# EAGLE design bottomboard (EAGLE 9.3.0)
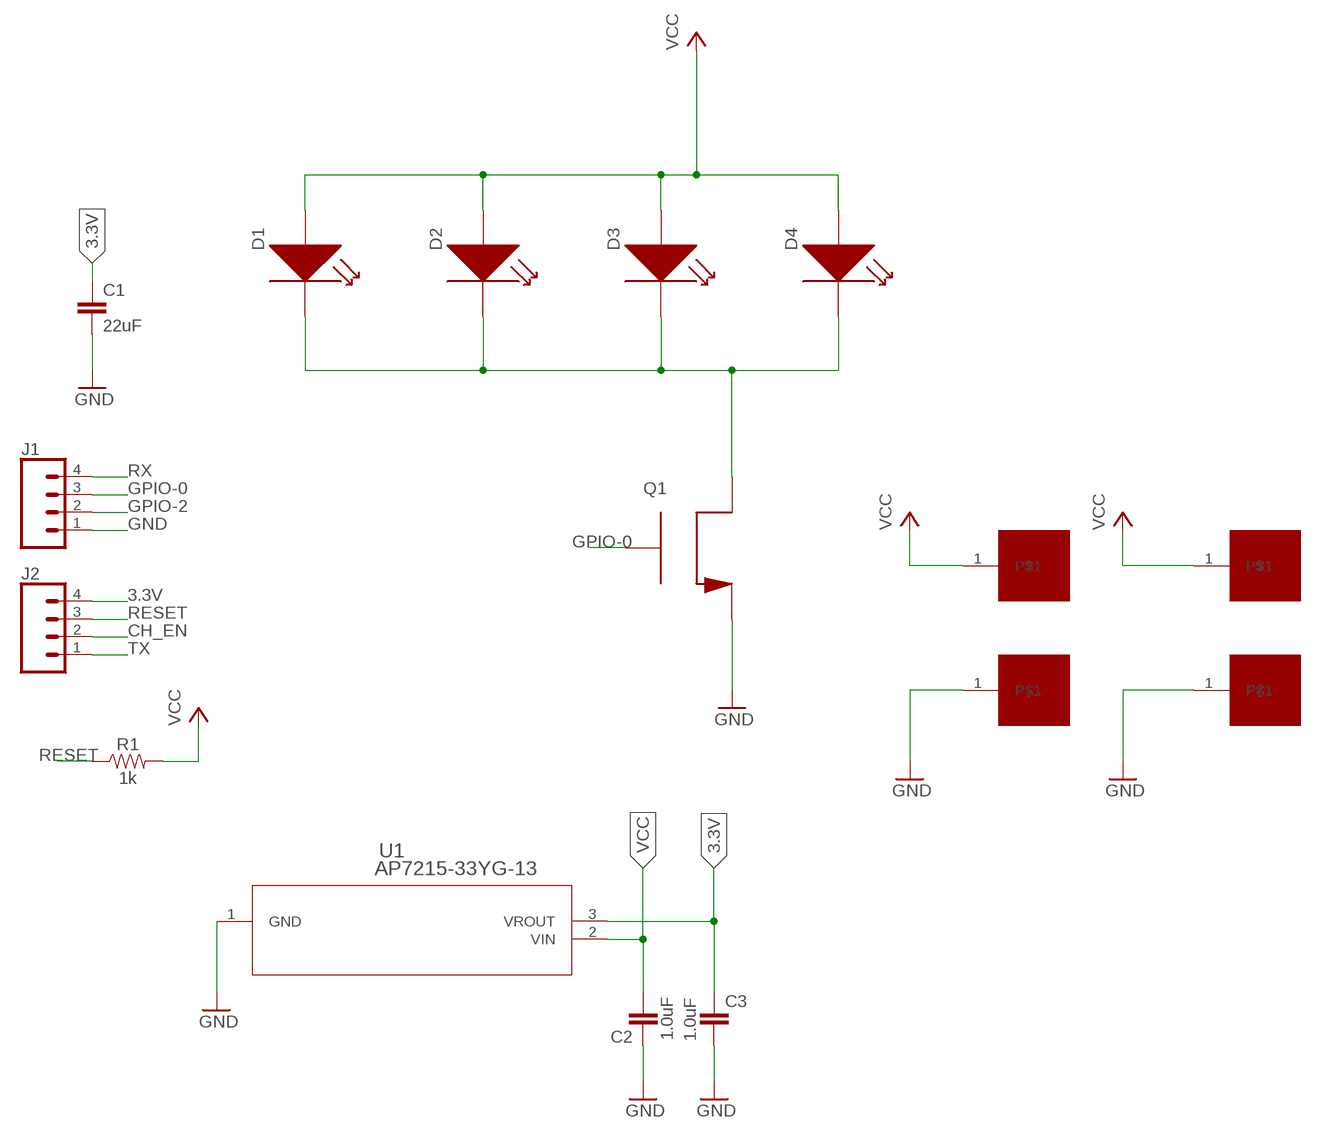
[diagram p0: schematic, sheet 1]

## Parts
C1  22uF  22UF-0805-6.3V-20%  [0805]
C2  1.0uF  1.0UF-0402-16V-10%  [0402]
C3  1.0uF  1.0UF-0402-16V-10%  [0402]
D1  NVSLE21AT  [NVSLE21AT]
D2  NVSLE21AT  [NVSLE21AT]
D3  NVSLE21AT  [NVSLE21AT]
D4  NVSLE21AT  [NVSLE21AT]
J1  CONN_04  [1X04]
J2  CONN_04  [1X04]
P1  PAD  [PAD]
P2  PAD  [PAD]
P3  PAD  [PAD]
P4  PAD  [PAD]
Q1  SIA436DJ  [POWERPAK_SC70-6L]
R1  1k  1KOHM-0603-1/10W-1%  [0603]
U1  AP7215-33YG-13  [SOT89-3L]

## Nets
3.3V: C1.1 C3.1 J2.4 U1.3(VROUT)
CH_EN: J2.2
GND: C1.2 C2.1 C3.2 J1.1 P2.1 P4.1 Q1.P$2(S) Q1.P$3(S) U1.1(GND)
GPIO-0: J1.3 Q1.P$4(G)
GPIO-2: J1.2
N$2: D1.P$1(CATHODE) D2.P$1(CATHODE) D3.P$1(CATHODE) D4.P$1(CATHODE) Q1.P$1(D) Q1.P$5(D) Q1.P$6(D) Q1.P$7(D) Q1.P$8(D)
RESET: J2.3 R1.1
RX: J1.4
TX: J2.1
VCC: C2.2 D1.P$2(ANODE) D2.P$2(ANODE) D3.P$2(ANODE) D4.P$2(ANODE) P1.1 P3.1 R1.2 U1.2(VIN)

## Library data of the parts
C1 = SparkFun-Capacitors:22UF: 22µF ceramic capacitors A capacitor is a passive two-terminal electrical component used to store electrical energy temporarily in an electric field.; PROD_ID: CAP-08402
C2 C3 = SparkFun-Capacitors:1.0UF: 1µF ceramic capacitors A capacitor is a passive two-terminal electrical component used to store electrical energy temporarily in an electric field.; PROD_ID: CAP-12417
D1-D4 = leds:NVSLE21AT
J1 J2 = SparkFun-Connectors:CONN_04: Multi connection point. Often used as Generic Header-pin footprint for 0.1 inch spaced/style header connections On any of the 0.1 inch spaced packages, you can populate with these: Break Away Headers - Straight <https://www.sparkfun.com/products/116> (PRT-00116) Break Away Male Headers - Right Angle <https://www.sparkfun.com/products/553> (PRT-00553) Female Headers <https://www.sparkfun.com/products/115> (PRT-00115) Break Away Headers - Machine Pin <https://www.sparkfun.com/products/117> (PRT-00117) Break Away Female Headers - Swiss Machine Pin <https://www.sparkfun.com/products/743> (PRT-00743) For SCREWTERMINALS and SPRING TERMINALS visit here: Screw Terimnals on SparkFun.com <https://www.sparkfun.com/search/results?term=Screw+Terminals> (5mm/3.5mm/2.54mm spacing) This device is also useful as a general connection point to wire up your design to another part of your project. Our various solder wires solder well into these plated through hole pads. Hook-Up Wire - Assortment (Stranded, 22 AWG) <https://www.sparkfun.com/products/11375> (PRT-11375) Hook-Up Wire - Assortment (Solid Core, 22 AWG) <https://www.sparkfun.com/products/11367> (PRT-11367) View the entire wire category on our website here <https://www.sparkfun.com/categories/141> Special notes: Molex polarized connector foot print use with SKU : PRT-08231 with associated crimp pins and housings. 1MM SMD Version SKU: PRT-10208; PROD_ID: CONN-09696
P1-P4 = pad:PAD
Q1 = transistors:SIA436DJ
R1 = SparkFun-Resistors:1KOHM: 1kΩ resistor A resistor is a passive two-terminal electrical component that implements electrical resistance as a circuit element. Resistors act to reduce current flow, and, at the same time, act to lower voltage levels within circuits. - Wikipedia; PROD_ID: RES-07856
U1 = AP7215-33YG-13:AP7215-33YG-13; MANUFACTURER_PART_NUMBER: AP721533YG13; VENDOR: Diodes Inc

## Board
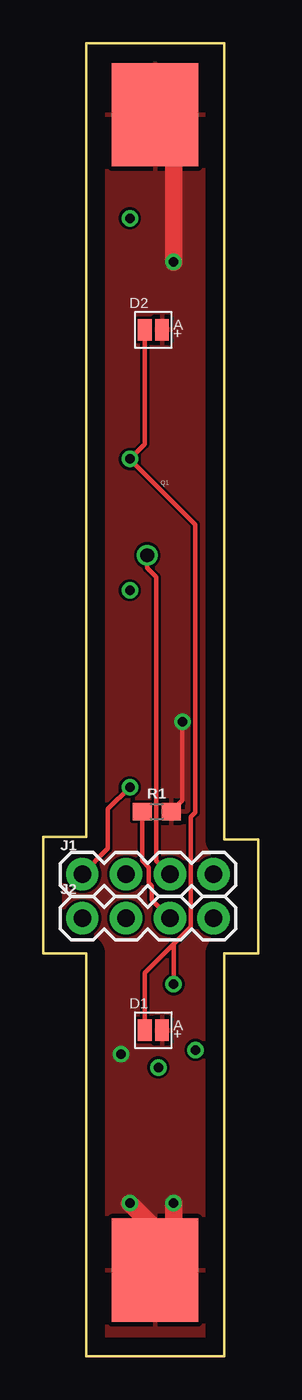
[diagram p1: board, top side]
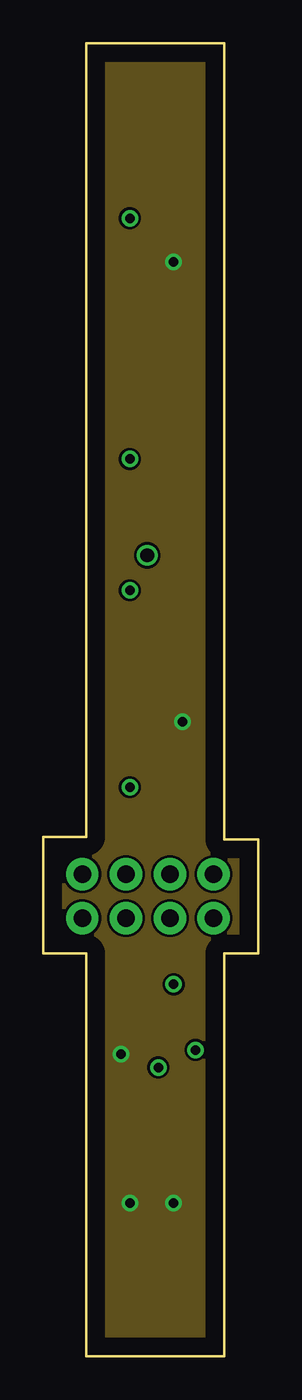
[diagram p2: board, inner layer Route2]
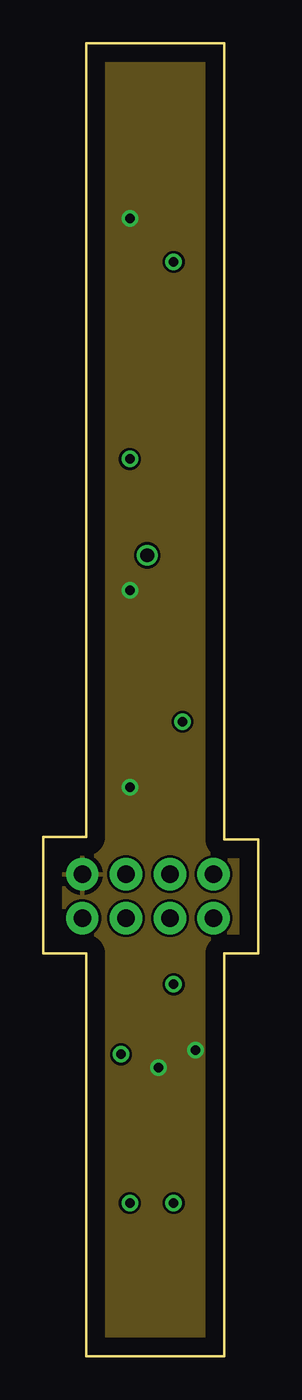
[diagram p3: board, inner layer Route15]
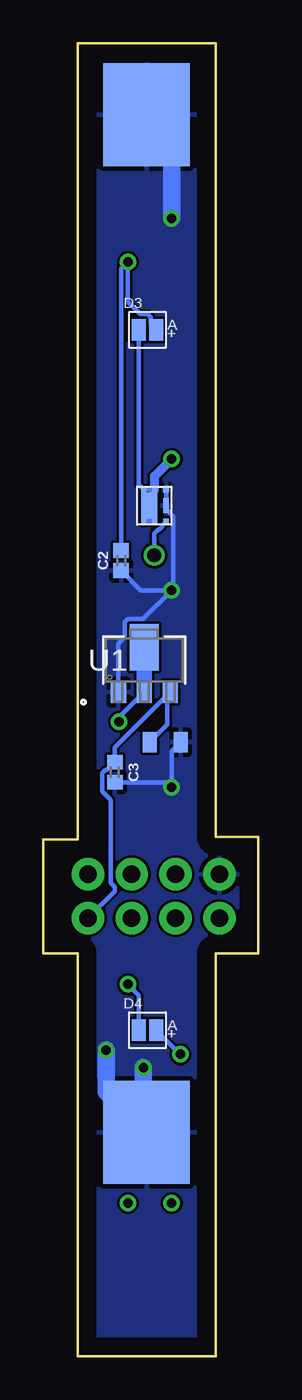
[diagram p4: board, bottom side, seen from below]

Size 12.49 x 76.2 mm. Coordinates in mm from the lower left corner, seen from the top.
Outline: 2.49,0 2.49,23.38 0,23.38 0,30.13 2.49,30.13 2.49,76.2 10.49,76.2 10.49,30 12.49,30 12.49,23.38 10.49,23.38 10.49,0 2.49,0
Copper layers (1*2*15*16): Top 0.035mm / dielectric 1.5mm / Route2 0.035mm / dielectric 0.15mm / Route15 0.035mm / dielectric 0.2mm / Bottom 0.035mm
Design rules "default *": minimum track width 6mil, minimum drill 0.35mm, track to track 6mil, track to pad 6mil, pad to pad 6mil, via to via 6mil, smd to smd 6mil, copper to edge 40mil, drill to drill 6mil, minimum pad ring 10mil, minimum via ring 8mil, stop-mask expansion 4mil, vias tented up to drill 0mil, thermal gap 10mil

### Footprints (pad centres in the part's own frame; a part is rotated, then mirrored left to right if it is on the bottom)
0805 = smd 0.8 x 1.2: 1 -0.9,0; 2 0.9,0
0402 = smd 0.85 x 0.9: 1 -0.58,0; 2 0.58,0
NVSLE21AT = smd 0.8 x 1.26: P$1 0,0; P$2 1.001,0
1X04 = drill 1.016 pad 1.88: 1 0,0; 2 2.54,0; 3 5.08,0; 4 7.62,0
PAD = smd 5 x 6: 1 0,0
POWERPAK_SC70-6L = smd 0.94 x 1.499: P$1 0.47,1.105 | smd 0.305 x 0.356: P$2 1.448,2.032; P$4 1.448,0.178; P$5 0.152,2.032; P$6 0.787,2.032; P$7 0.152,0.178; P$8 0.787,0.178 | smd 0.305 x 0.864: P$3 1.448,1.105
0603 = smd 1.1 x 1: 1 -0.85,0; 2 0.85,0
SOT89-3L = smd 0.889 x 1.295: 1 -1.5,-1.854; 2 0,-1.854; 3 1.5,-1.854 | smd 1.702 x 2.692: 4 0,0.749

### Placement (x,y rotation side)
C1  5.41,35.64 0 bottom
C2  7.97,46.18 90 bottom
C3  8.33,33.89 270 bottom
D1  5.9,18.92 0 top
D2  5.9,59.56 0 top
D3  6.94,59.56 0 bottom
D4  6.94,18.92 0 bottom
J1  2.27,27.97 0 top
J2  2.27,25.43 0 top
P1  6.49,5 0 top
P2  6.49,13 0 bottom
P3  6.49,72.04 0 top
P4  6.49,72.04 0 bottom
Q1  6.81,48.26 0 bottom
R1  6.59,31.61 0 top
U1  6.62,40.4 0 bottom

### Tracks (layer width: path | path; a pad name or v marks a point on that pad's centre or on a via)
3.3V
  Bottom 0.254: C1.1 5.3,36.65 5.3,38.37 U1.3 8.33,35.33 C3.1 8.79,34.02 8.9,34.02 9.06,33.85 9.06,32.77 8.57,32.28 8.57,27.46 8.33,27.23 8.33,26.99 J2.4
GND  (via drill 0.55)
  Top 0.254: J1.1 3.76,29.46 3.76,31.75 v5.03,33.02
  Bottom 0.254: C2.1 6.82,44.45 v5.03,44.45 | Q1.P$2 Q1.P$3 5.36,49.16 4.93,48.73 4.93,44.55 v5.03,44.45 | C1.2 5.03,35.12 v5.03,33.02 5.33,33.31 C3.2 | U1.1 8.12,41.36 7.75,41.73 7.75,42.61 7.59,42.77 6.71,42.77 v5.03,44.45
  Bottom 1.016: v8.84,17.78 8.84,15.35 6.88,13.39 | 6.88,13.39 P2.1 | v6.68,16.76 6.68,13.39 6.88,13.39 | v5.03,66.04 5.03,70.58 P4.1
  pour Route15: -1.32,-1.27 -1.32,76.2 15.19,76.2 15.19,-1.27
  pour Bottom: -1.32,0 15.19,0 15.19,76.2 -1.32,76.2
GPIO-0  (via drill 0.8)
  Top 0.254: J1.3 6.57,28.75 6.57,45.21 6.05,45.73 v6.05,46.48
  Bottom 0.254: v6.05,46.48 6.05,47.75 5.82,47.98 5.75,47.98 5.59,48.14 5.59,48.21 Q1.P$4
N$2  (via drill 0.55)
  Top 0.254: D1.P$1 5.9,22.25 7.57,23.93 | 7.57,23.93 8.57,24.93 8.57,31.3 8.84,31.56 8.84,48.26 v5.03,52.07 5.9,52.93 D2.P$1 | v7.57,21.59 7.57,23.93
  Bottom 0.254: 6.34,48.76 Q1.P$7 Q1.P$8 6.34,48.76 | 6.34,48.76 Q1.P$1 6.34,49.97 Q1.P$6 Q1.P$5 6.94,50.57 D3.P$1 | D4.P$1 6.94,20.95 v7.57,21.59
  Bottom 0.508: Q1.P$6 6.02,51.08 v5.03,52.07
RESET
  Top 0.254: R1.1 5.74,28.77 6.13,28.37 6.13,27.46 6.3,27.3 6.3,26.48 J2.3
VCC  (via drill 0.55)
  Top 0.254: R1.2 8.08,32.25 v8.08,36.83
  Top 1.016: v5.03,8.89 6.49,7.43 P1.1 7.57,6.08 v7.57,8.89 | v7.57,63.5 7.57,70.96 P3.1
  Bottom 0.254: D4.P$2 4.54,17.53 v4.52,17.53 | U1.2 8.08,37.09 v8.08,36.83 | D3.P$2 6.26,59.88 6.26,60.31 6.42,60.47 6.85,60.47 7.57,61.2 v7.57,63.5 7.97,63.1 C2.2
  pour Route2: -1.32,-1.27 -1.32,76.2 15.19,76.2 15.19,-1.27
  pour Top: -3.86,0 16.46,0 16.46,76.2 -3.86,76.2